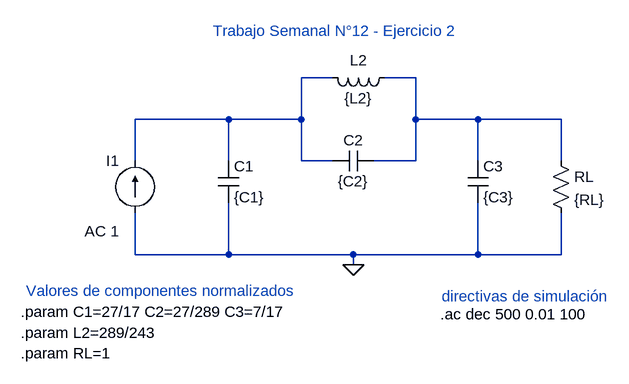
[diagram p0: schematic TS12_ej2.asc]
TS12_ej2.asc, the LTspice schematic file:
Version 4
SHEET 1 880 680
WIRE 368 16 320 16
WIRE 496 16 448 16
WIRE 208 80 64 80
WIRE 320 80 320 16
WIRE 320 80 208 80
WIRE 496 80 496 16
WIRE 592 80 496 80
WIRE 720 80 592 80
WIRE 64 144 64 80
WIRE 208 144 208 80
WIRE 320 144 320 80
WIRE 368 144 320 144
WIRE 496 144 496 80
WIRE 496 144 432 144
WIRE 592 144 592 80
WIRE 720 144 720 80
WIRE 64 288 64 224
WIRE 208 288 208 208
WIRE 208 288 64 288
WIRE 400 288 208 288
WIRE 592 288 592 208
WIRE 592 288 400 288
WIRE 720 288 720 224
WIRE 720 288 592 288
WIRE 400 304 400 288
FLAG 400 304 0
SYMBOL current 64 224 R180
WINDOW 0 24 80 Left 2
WINDOW 3 24 0 Left 2
WINDOW 123 24 -28 Left 2
WINDOW 39 0 0 Left 0
SYMATTR InstName I1
SYMATTR Value ""
SYMATTR Value2 AC 1
SYMBOL cap 192 144 R0
SYMATTR InstName C1
SYMATTR Value {C1}
SYMBOL cap 432 128 R90
WINDOW 0 0 32 VBottom 2
WINDOW 3 32 32 VTop 2
SYMATTR InstName C2
SYMATTR Value {C2}
SYMBOL cap 576 144 R0
SYMATTR InstName C3
SYMATTR Value {C3}
SYMBOL ind 464 0 R90
WINDOW 0 5 56 VBottom 2
WINDOW 3 32 56 VTop 2
SYMATTR InstName L2
SYMATTR Value {L2}
SYMBOL res 704 128 R0
SYMATTR InstName RL
SYMATTR Value {RL}
TEXT 184 -56 Left 2 ;Trabajo Semanal N°12 - Ejercicio 2
TEXT -104 344 Left 2 ;Valores de componentes normalizados
TEXT 536 352 Left 2 ;directivas de simulación
TEXT -112 376 Left 2 !.param C1=27/17 C2=27/289 C3=7/17
TEXT -112 408 Left 2 !.param L2=289/243
TEXT -112 440 Left 2 !.param RL=1
TEXT 534 380 Left 2 !.ac dec 500 0.01 100

The netlist it stands for:
* TS12_ej2.asc
I1 0 N001 AC 1
C1 N001 0 {C1}
C2 N002 N001 {C2}
C3 N002 0 {C3}
L2 N002 N001 {L2}
RL N002 0 {RL}
* Trabajo Semanal N°12 - Ejercicio 2
* Valores de componentes normalizados
* directivas de simulación
.param C1=27/17 C2=27/289 C3=7/17
.param L2=289/243
.param RL=1
.ac dec 500 0.01 100
.backanno
.end